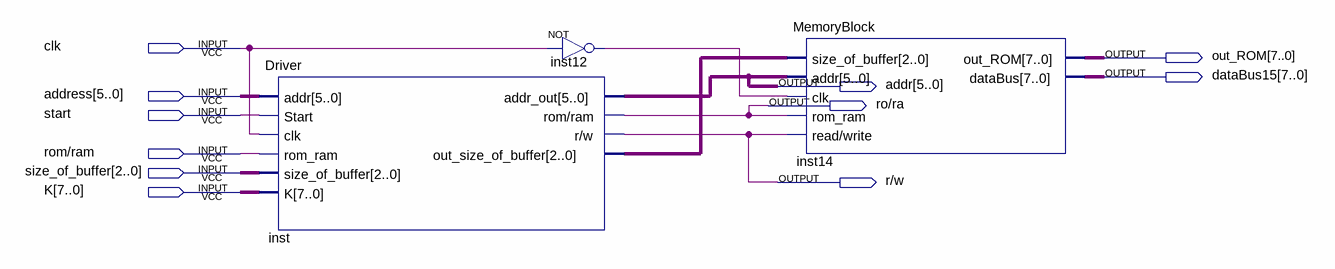
[diagram p0: schematic sheet]
// Quartus schematic Lab3(2).bdf as structural Verilog: 3 symbols, 11 pins
module \Lab3(2)  (
  input  clk,
  input  [5:0] address,
  input  start,
  input  \rom/ram ,
  input  [2:0] size_of_buffer,
  input  [7:0] K,
  output [7:0] out_ROM,
  output [7:0] dataBus15,
  output [5:0] addr,
  output \ro/ra ,
  output \r/w 
);

  wire inst12_out;
  wire [2:0] inst_out_size_of_buffer;

  Driver inst (
    .addr(address), .Start(start), .clk(clk), .rom_ram(\rom/ram ), .size_of_buffer(size_of_buffer), .K(K),
    .addr_out(addr), .\rom/ram (\ro/ra ), .\r/w (\r/w ), .out_size_of_buffer(inst_out_size_of_buffer));
  not inst12 (inst12_out, clk);
  MemoryBlock inst14 (
    .size_of_buffer(inst_out_size_of_buffer), .addr(addr), .clk(inst12_out), .rom_ram(\ro/ra ),
    .\read/write (\r/w ), .out_ROM(out_ROM), .dataBus(dataBus15));
endmodule
